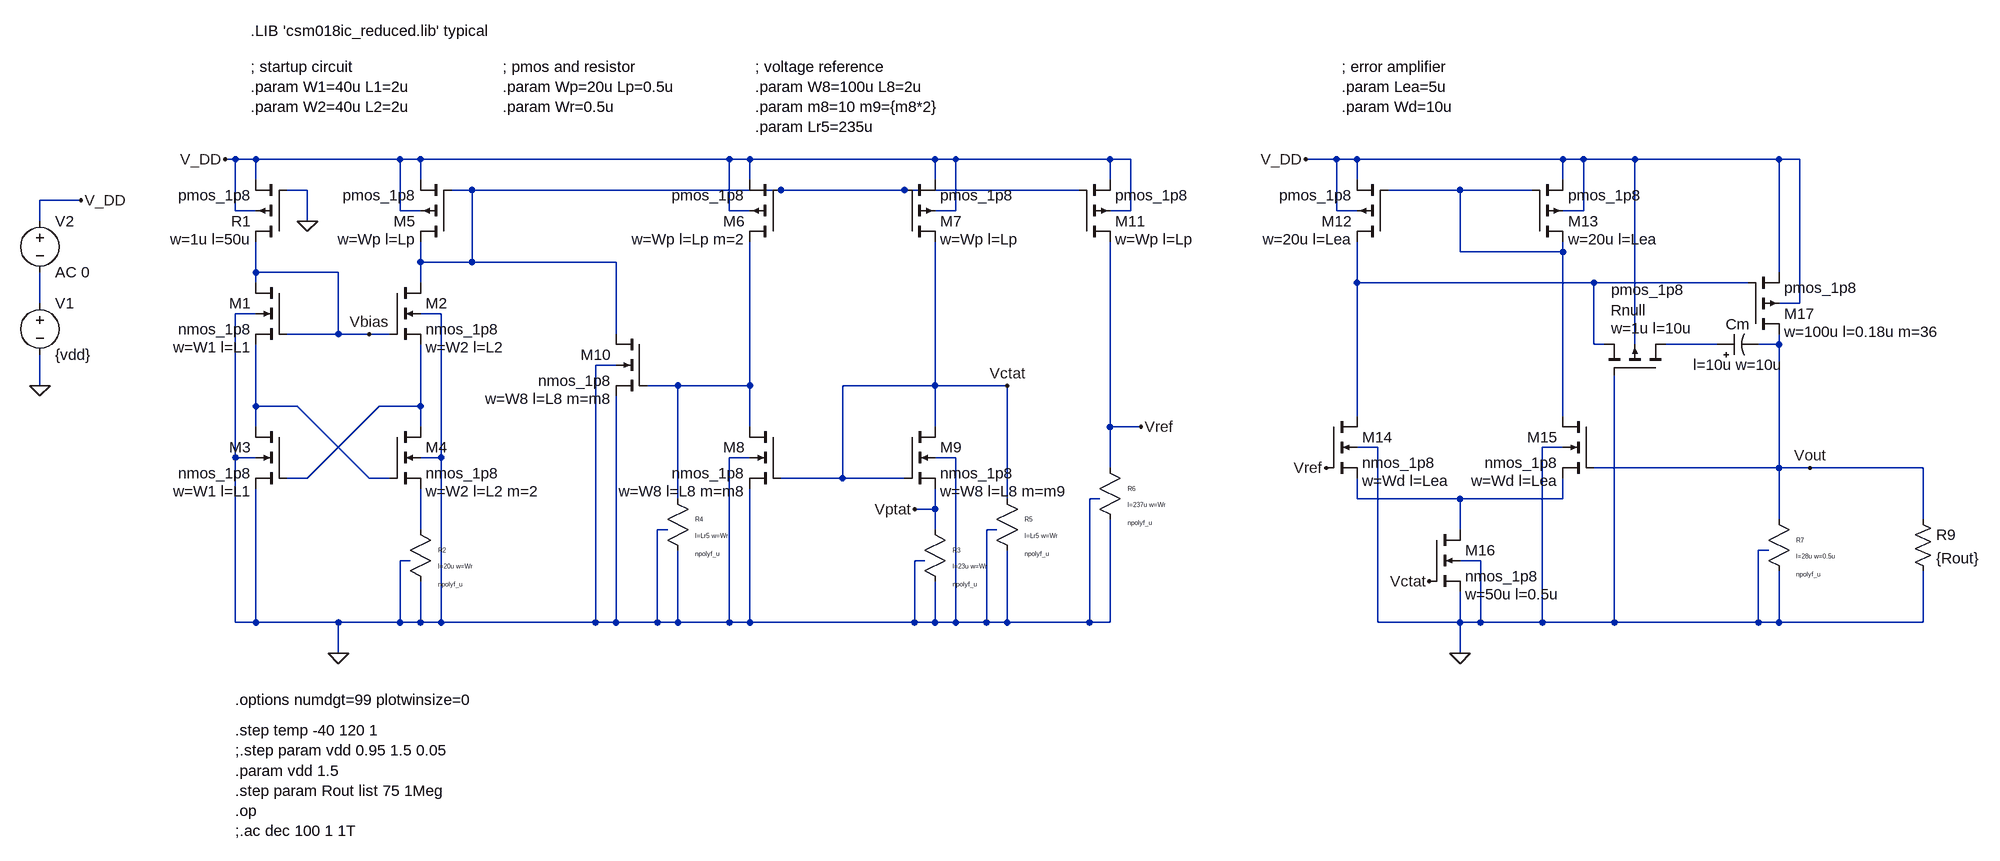
[diagram p0: schematic ldo.asc]
ldo.asc, the LTspice schematic file:
Version 4
SHEET 1 2832 892
WIRE 112 -144 96 -144
WIRE 144 -144 112 -144
WIRE 368 -144 144 -144
WIRE 400 -144 368 -144
WIRE 880 -144 400 -144
WIRE 912 -144 880 -144
WIRE 1200 -144 912 -144
WIRE 1232 -144 1200 -144
WIRE 1472 -144 1232 -144
WIRE 1504 -144 1472 -144
WIRE 1824 -144 1776 -144
WIRE 1856 -144 1824 -144
WIRE 2176 -144 1856 -144
WIRE 2208 -144 2176 -144
WIRE 2288 -144 2208 -144
WIRE 2512 -144 2288 -144
WIRE 2544 -144 2512 -144
WIRE 144 -112 144 -144
WIRE 400 -112 400 -144
WIRE 912 -112 912 -144
WIRE 1200 -112 1200 -144
WIRE 1472 -112 1472 -144
WIRE 1856 -112 1856 -144
WIRE 2176 -112 2176 -144
WIRE 224 -96 192 -96
WIRE 480 -96 448 -96
WIRE 960 -96 480 -96
WIRE 1152 -96 960 -96
WIRE 1424 -96 1152 -96
WIRE 2016 -96 1904 -96
WIRE 2128 -96 2016 -96
WIRE -128 -80 -192 -80
WIRE 112 -64 112 -144
WIRE 144 -64 112 -64
WIRE 368 -64 368 -144
WIRE 400 -64 368 -64
WIRE 880 -64 880 -144
WIRE 912 -64 880 -64
WIRE 1232 -64 1232 -144
WIRE 1232 -64 1200 -64
WIRE 1504 -64 1504 -144
WIRE 1504 -64 1472 -64
WIRE 1824 -64 1824 -144
WIRE 1856 -64 1824 -64
WIRE 2208 -64 2208 -144
WIRE 2208 -64 2176 -64
WIRE -192 -48 -192 -80
WIRE 224 -48 224 -96
WIRE 2016 0 2016 -96
WIRE 2176 0 2176 -16
WIRE 2176 0 2016 0
WIRE 400 16 400 -16
WIRE 480 16 480 -96
WIRE 480 16 400 16
WIRE 704 16 480 16
WIRE 144 32 144 -16
WIRE 272 32 144 32
WIRE 2512 32 2512 -144
WIRE 144 48 144 32
WIRE 400 48 400 16
WIRE 1856 48 1856 -16
WIRE 2224 48 1856 48
WIRE 2464 48 2224 48
WIRE -192 80 -192 32
WIRE 2544 80 2544 -144
WIRE 2544 80 2512 80
WIRE 144 96 112 96
WIRE 432 96 400 96
WIRE 272 128 272 32
WIRE 272 128 192 128
WIRE 320 128 272 128
WIRE 352 128 320 128
WIRE 704 128 704 16
WIRE 2224 144 2224 48
WIRE 2240 144 2224 144
WIRE 2288 144 2288 -144
WIRE 2416 144 2336 144
WIRE 2512 144 2512 128
WIRE 2512 144 2480 144
WIRE 704 176 672 176
WIRE -192 208 -192 160
WIRE 800 208 752 208
WIRE 912 208 912 -16
WIRE 912 208 800 208
WIRE 1200 208 1200 -16
WIRE 1200 208 1056 208
WIRE 1312 208 1200 208
WIRE 144 240 144 144
WIRE 208 240 144 240
WIRE 400 240 400 144
WIRE 400 240 336 240
WIRE 1856 256 1856 48
WIRE 2176 256 2176 0
WIRE 144 272 144 240
WIRE 400 272 400 240
WIRE 912 272 912 208
WIRE 1200 272 1200 208
WIRE 1472 272 1472 -16
WIRE 1520 272 1472 272
WIRE 1888 304 1856 304
WIRE 2176 304 2144 304
WIRE 112 320 112 96
WIRE 144 320 112 320
WIRE 432 320 432 96
WIRE 432 320 400 320
WIRE 912 320 880 320
WIRE 1232 320 1200 320
WIRE 1472 336 1472 272
WIRE 2512 336 2512 144
WIRE 2512 336 2224 336
WIRE 2560 336 2512 336
WIRE 2736 336 2560 336
WIRE 224 352 336 240
WIRE 224 352 192 352
WIRE 320 352 208 240
WIRE 352 352 320 352
WIRE 1056 352 1056 208
WIRE 1056 352 960 352
WIRE 1152 352 1056 352
WIRE 800 384 800 208
WIRE 1312 384 1312 208
WIRE 1456 384 1440 384
WIRE 1856 384 1856 352
WIRE 2016 384 1856 384
WIRE 2176 384 2176 352
WIRE 2176 384 2016 384
WIRE 1200 400 1200 368
WIRE 1200 400 1168 400
WIRE 2512 416 2512 336
WIRE 2736 416 2736 336
WIRE 400 432 400 368
WIRE 784 432 768 432
WIRE 1200 432 1200 400
WIRE 1296 432 1280 432
WIRE 2016 432 2016 384
WIRE 2496 464 2480 464
WIRE 384 480 368 480
WIRE 1184 480 1168 480
WIRE 2048 480 2016 480
WIRE 112 576 112 320
WIRE 144 576 144 368
WIRE 144 576 112 576
WIRE 272 576 144 576
WIRE 368 576 368 480
WIRE 368 576 272 576
WIRE 400 576 400 512
WIRE 400 576 368 576
WIRE 432 576 432 320
WIRE 432 576 400 576
WIRE 672 576 672 176
WIRE 672 576 432 576
WIRE 704 576 704 224
WIRE 704 576 672 576
WIRE 768 576 768 432
WIRE 768 576 704 576
WIRE 800 576 800 464
WIRE 800 576 768 576
WIRE 880 576 880 320
WIRE 880 576 800 576
WIRE 912 576 912 368
WIRE 912 576 880 576
WIRE 1168 576 1168 480
WIRE 1168 576 912 576
WIRE 1200 576 1200 512
WIRE 1200 576 1168 576
WIRE 1232 576 1232 320
WIRE 1232 576 1200 576
WIRE 1280 576 1280 432
WIRE 1280 576 1232 576
WIRE 1312 576 1312 464
WIRE 1312 576 1280 576
WIRE 1440 576 1440 384
WIRE 1440 576 1312 576
WIRE 1472 576 1472 416
WIRE 1472 576 1440 576
WIRE 1888 576 1888 304
WIRE 2016 576 2016 528
WIRE 2016 576 1888 576
WIRE 2048 576 2048 480
WIRE 2048 576 2016 576
WIRE 2144 576 2144 304
WIRE 2144 576 2048 576
WIRE 2256 576 2256 192
WIRE 2256 576 2144 576
WIRE 2480 576 2480 464
WIRE 2480 576 2256 576
WIRE 2512 576 2512 496
WIRE 2512 576 2480 576
WIRE 2736 576 2736 496
WIRE 2736 576 2512 576
WIRE 272 624 272 576
WIRE 2016 624 2016 576
FLAG 96 -144 V_DD
FLAG -192 208 0
FLAG -128 -80 V_DD
FLAG 272 624 0
FLAG 1168 400 Vptat
FLAG 1312 208 Vctat
FLAG 1520 272 Vref
FLAG 2560 336 Vout
FLAG 320 128 Vbias
FLAG 1968 512 Vctat
FLAG 1808 336 Vref
FLAG 1776 -144 V_DD
FLAG 2016 624 0
FLAG 224 -48 0
SYMBOL nmos4 192 48 M0
WINDOW 123 56 100 Left 2
SYMATTR Value2 w=W1 l=L1
SYMATTR InstName M1
SYMATTR Value nmos_1p8
SYMBOL nmos4 192 272 M0
WINDOW 123 56 100 Left 2
SYMATTR Value2 w=W1 l=L1
SYMATTR InstName M3
SYMATTR Value nmos_1p8
SYMBOL nmos4 352 48 R0
WINDOW 123 56 100 Left 2
SYMATTR Value2 w=W2 l=L2
SYMATTR InstName M2
SYMATTR Value nmos_1p8
SYMBOL nmos4 352 272 R0
WINDOW 123 56 100 Left 2
SYMATTR Value2 w=W2 l=L2 m=2
SYMATTR InstName M4
SYMATTR Value nmos_1p8
SYMBOL voltage -192 64 R0
WINDOW 123 0 0 Left 0
WINDOW 39 0 0 Left 0
SYMATTR InstName V1
SYMATTR Value {vdd}
SYMBOL pmos4 960 -16 R180
WINDOW 123 56 4 Left 2
SYMATTR Value2 w=Wp l=Lp m=2
SYMATTR InstName M6
SYMATTR Value pmos_1p8
SYMBOL pmos4 1152 -16 M180
WINDOW 123 56 4 Left 2
SYMATTR Value2 w=Wp l=Lp
SYMATTR InstName M7
SYMATTR Value pmos_1p8
SYMBOL nmos4 960 272 M0
WINDOW 123 56 100 Left 2
SYMATTR Value2 w=W8 l=L8 m=m8
SYMATTR InstName M8
SYMATTR Value nmos_1p8
SYMBOL nmos4 1152 272 R0
WINDOW 123 56 100 Left 2
SYMATTR Value2 w=W8 l=L8 m=m9
SYMATTR InstName M9
SYMATTR Value nmos_1p8
SYMBOL nmos4 752 128 M0
WINDOW 123 56 100 Left 2
SYMATTR Value2 w=W8 l=L8 m=m8
SYMATTR InstName M10
SYMATTR Value nmos_1p8
SYMBOL pmos4 448 -16 R180
WINDOW 123 56 4 Left 2
SYMATTR Value2 w=Wp l=Lp
SYMATTR InstName M5
SYMATTR Value pmos_1p8
SYMBOL pmos4 1424 -16 M180
WINDOW 123 56 4 Left 2
SYMATTR Value2 w=Wp l=Lp
SYMATTR InstName M11
SYMATTR Value pmos_1p8
SYMBOL pmos4 1904 -16 R180
WINDOW 123 56 4 Left 2
SYMATTR Value2 w=20u l=Lea
SYMATTR InstName M12
SYMATTR Value pmos_1p8
SYMBOL pmos4 2128 -16 M180
WINDOW 123 56 4 Left 2
SYMATTR Value2 w=20u l=Lea
SYMATTR InstName M13
SYMATTR Value pmos_1p8
SYMBOL nmos4 1808 256 R0
WINDOW 123 56 100 Left 2
SYMATTR Value2 w=Wd l=Lea
SYMATTR InstName M14
SYMATTR Value nmos_1p8
SYMBOL nmos4 2224 256 M0
WINDOW 123 56 100 Left 2
SYMATTR Value2 w=Wd l=Lea
SYMATTR InstName M15
SYMATTR Value nmos_1p8
SYMBOL nmos4 1968 432 R0
WINDOW 123 56 100 Left 2
SYMATTR Value2 w=50u l=0.5u
SYMATTR InstName M16
SYMATTR Value nmos_1p8
SYMBOL pmos4 2464 128 M180
WINDOW 123 56 4 Left 2
SYMATTR Value2 w=100u l=0.18u m=36
SYMATTR InstName M17
SYMATTR Value pmos_1p8
SYMBOL res 2720 400 R0
SYMATTR InstName R9
SYMATTR Value {Rout}
SYMBOL pmos4 192 -16 R180
WINDOW 123 56 4 Left 2
SYMATTR Value2 w=1u l=50u
SYMATTR InstName R1
SYMATTR Value pmos_1p8
SYMBOL res3 384 464 R0
WINDOW 38 43 53 Left 0
SYMATTR SpiceModel npolyf_u
SYMATTR InstName R2
SYMATTR Value l=20u w=Wr
SYMATTR Prefix X
SYMBOL res3 1184 464 R0
WINDOW 38 43 53 Left 0
SYMATTR SpiceModel npolyf_u
SYMATTR InstName R3
SYMATTR Value l=23u w=Wr
SYMATTR Prefix X
SYMBOL res3 784 416 R0
WINDOW 38 43 53 Left 0
SYMATTR SpiceModel npolyf_u
SYMATTR InstName R4
SYMATTR Value l=Lr5 w=Wr
SYMATTR Prefix X
SYMBOL res3 1296 416 R0
WINDOW 38 43 53 Left 0
SYMATTR SpiceModel npolyf_u
SYMATTR InstName R5
SYMATTR Value l=Lr5 w=Wr
SYMATTR Prefix X
SYMBOL res3 1456 368 R0
WINDOW 38 43 53 Left 0
SYMATTR SpiceModel npolyf_u
SYMATTR InstName R6
SYMATTR Value l=237u w=Wr
SYMATTR Prefix X
SYMBOL res3 2496 448 R0
WINDOW 38 43 53 Left 0
SYMATTR SpiceModel npolyf_u
SYMATTR InstName R7
SYMATTR Value l=28u w=0.5u
SYMATTR Prefix X
SYMBOL pmos4 2336 192 M270
WINDOW 123 73 85 VLeft 2
WINDOW 0 101 86 VLeft 2
WINDOW 3 133 85 VLeft 2
SYMATTR Value2 w=1u l=10u
SYMATTR InstName Rnull
SYMATTR Value pmos_1p8
SYMBOL polcap 2416 160 R270
WINDOW 0 32 32 VTop 2
WINDOW 3 0 32 VBottom 2
SYMATTR InstName Cm
SYMATTR Value l=10u w=10u
SYMATTR Prefix X
SYMATTR SpiceModel MIM
SYMBOL voltage -192 -64 R0
SYMATTR InstName V2
SYMATTR Value AC 0
TEXT 136 -344 Left 2 !.LIB 'csm018ic_reduced.lib' typical
TEXT 112 696 Left 2 !.options numdgt=99 plotwinsize=0
TEXT 136 -288 Left 2 !; startup circuit\n.param W1=40u L1=2u\n.param W2=40u L2=2u
TEXT 112 744 Left 2 !.step temp -40 120 1\n;.step param vdd 0.95 1.5 0.05\n.param vdd 1.5\n.step param Rout list 75 1Meg\n.op\n;.ac dec 100 1 1T
TEXT 920 -288 Left 2 !; voltage reference\n.param W8=100u L8=2u\n.param m8=10 m9={m8*2}\n.param Lr5=235u
TEXT 528 -288 Left 2 !; pmos and resistor\n.param Wp=20u Lp=0.5u\n.param Wr=0.5u
TEXT 1832 -288 Left 2 !; error amplifier\n.param Lea=5u\n.param Wd=10u

The netlist it stands for:
* ldo.asc
M1 Vbias Vbias N007 0 nmos_1p8 w=W1 l=L1
M3 N007 N008 0 0 nmos_1p8 w=W1 l=L1
M2 N001 Vbias N008 0 nmos_1p8 w=W2 l=L2
M4 N008 N007 N010 0 nmos_1p8 w=W2 l=L2 m=2
V1 N004 0 {vdd}
M6 N006 N001 V_DD V_DD pmos_1p8 w=Wp l=Lp m=2
M7 Vctat N001 V_DD V_DD pmos_1p8 w=Wp l=Lp
M8 N006 Vctat 0 0 nmos_1p8 w=W8 l=L8 m=m8
M9 Vctat Vctat Vptat 0 nmos_1p8 w=W8 l=L8 m=m9
M10 N001 N006 0 0 nmos_1p8 w=W8 l=L8 m=m8
M5 N001 N001 V_DD V_DD pmos_1p8 w=Wp l=Lp
M11 Vref N001 V_DD V_DD pmos_1p8 w=Wp l=Lp
M12 N003 N002 V_DD V_DD pmos_1p8 w=20u l=Lea
M13 N002 N002 V_DD V_DD pmos_1p8 w=20u l=Lea
M14 N003 Vref N009 0 nmos_1p8 w=Wd l=Lea
M15 N002 Vout N009 0 nmos_1p8 w=Wd l=Lea
M16 N009 Vctat 0 0 nmos_1p8 w=50u l=0.5u
M17 Vout N003 V_DD V_DD pmos_1p8 w=100u l=0.18u m=36
R9 Vout 0 {Rout}
M§R1 Vbias 0 V_DD V_DD pmos_1p8 w=1u l=50u
XR2 N010 0 0 npolyf_u l=20u w=Wr  ; pins B A C
XR3 Vptat 0 0 npolyf_u l=23u w=Wr  ; pins B A C
XR4 N006 0 0 npolyf_u l=Lr5 w=Wr  ; pins B A C
XR5 Vctat 0 0 npolyf_u l=Lr5 w=Wr  ; pins B A C
XR6 Vref 0 0 npolyf_u l=237u w=Wr  ; pins B A C
XR7 Vout 0 0 npolyf_u l=28u w=0.5u  ; pins B A C
M§Rnull N005 0 N003 V_DD pmos_1p8 w=1u l=10u
XCm N005 Vout MIM l=10u w=10u  ; pins A B
V2 V_DD N004 AC 0
.model NMOS NMOS
.model PMOS PMOS
.lib standard.mos
.LIB 'csm018ic_reduced.lib' typical
.options numdgt=99 plotwinsize=0
; startup circuit
.param W1=40u L1=2u
.param W2=40u L2=2u
.step temp -40 120 1
;.step param vdd 0.95 1.5 0.05
.param vdd 1.5
.step param Rout list 75 1Meg
.op
;.ac dec 100 1 1T
; voltage reference
.param W8=100u L8=2u
.param m8=10 m9={m8*2}
.param Lr5=235u
; pmos and resistor
.param Wp=20u Lp=0.5u
.param Wr=0.5u
; error amplifier
.param Lea=5u
.param Wd=10u
.backanno
.end